# Altium schematic sheet PowerOut.SchDoc
size Tabloid
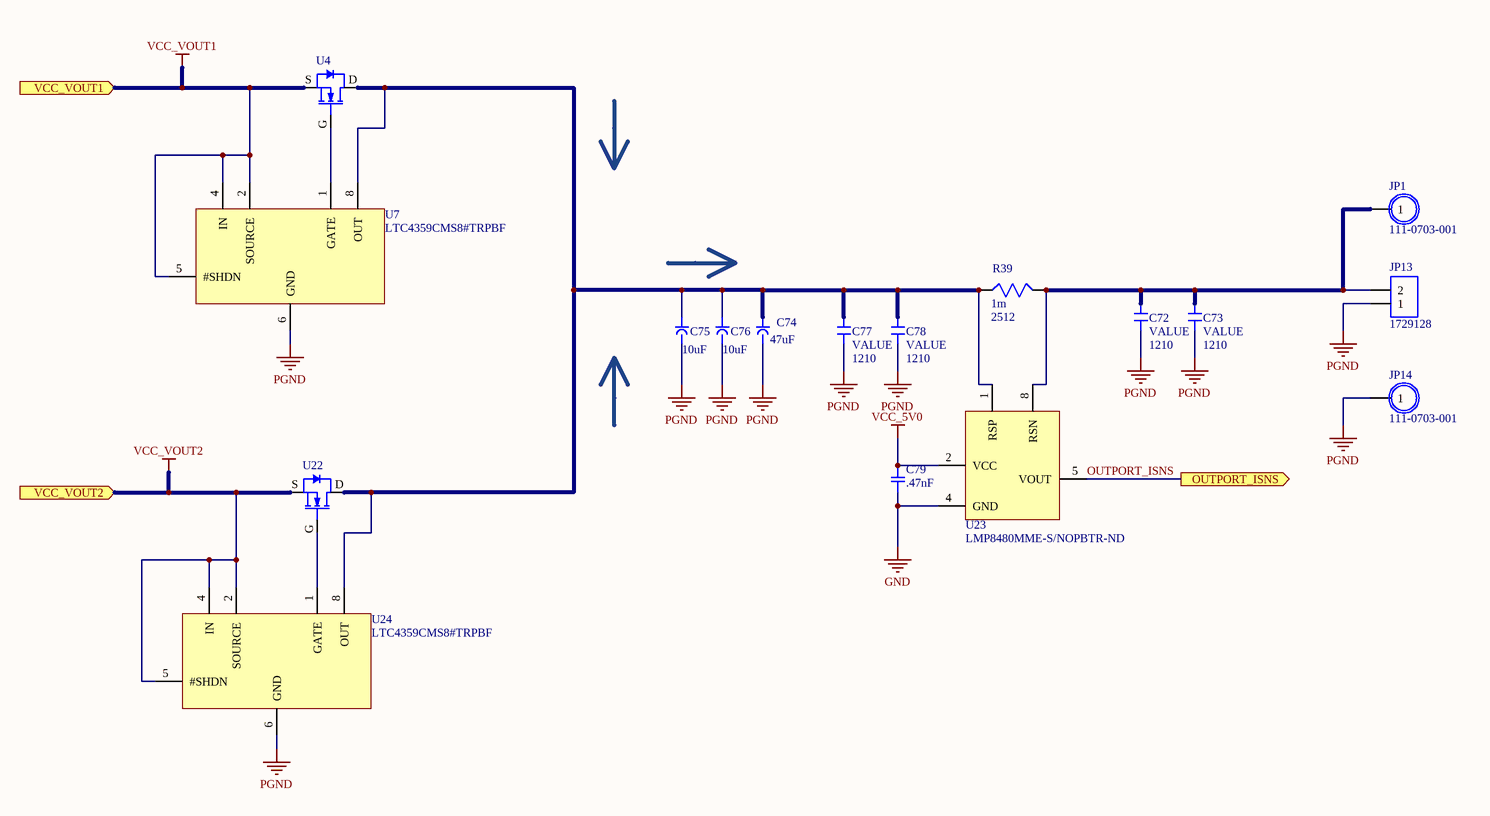
[diagram p0: PowerOut.SchDoc]

## Parts
C72  VALUE  Size: 1210  [1210 cap]
C73  VALUE  Size: 1210  [1210 cap]
C74  10-EEE-FN1K470UVTR-ND  [EEE-FN1K470UV]  (value not drawn)
C75  value 10uF  [panasonic d8]  (hidden comment: EEE-FN1K100XL)
C76  value 10uF  [panasonic d8]  (hidden comment: EEE-FN1K100XL)
C77  VALUE  Size: 1210  [1210 cap]
C78  VALUE  Size: 1210  [1210 cap]
C79  .47nF  [SMD-0603C]
JP1  111-0703-001  [Banana Jack Post]
JP13  1729128  [2x1_Term_Block]
JP14  111-0703-001  [Banana Jack Post]
R39  1m  [2512]
U4  (no value)  [PowerPAK® SO-8L SINGLE]
U7  LTC4359CMS8#TRPBF  [8-MSOP]
U22  (no value)  [PowerPAK® SO-8L SINGLE]
U23  LMP8480MME-S/NOPBTR-ND  [DGK(S-PDSO-G8)]
U24  LTC4359CMS8#TRPBF  [8-MSOP]

## Ports
OUTPORT_ISNS (out), VCC_VOUT1 (in), VCC_VOUT2 (in)

## Nets
GND: C79.2 U23.4(GND)
PGND: C72.2 C73.2 C74.1 C75.2 C76.2 C77.2 C78.2 JP13.1 JP14.1 U7.6(GND) U24.6(GND)
VCC_5V0: C79.1 U23.2(VCC)
VCC_VOUT1: U4.S(SOURCE) U7.2(SOURCE) U7.4(IN) U7.5(#SHDN) ; port VCC_VOUT1
VCC_VOUT2: U22.S(SOURCE) U24.2(SOURCE) U24.4(IN) U24.5(#SHDN) ; port VCC_VOUT2
OUTPORT_ISNS: U23.5(VOUT) ; port OUTPORT_ISNS
NetC72_1: C72.1 C73.1 JP1.1 JP13.2 R39.2 U23.8(RSN)
NetC74_2: C74.2 C75.1 C76.1 C77.1 C78.1 R39.1 U4.D(DRAIN) U7.8(OUT) U22.D(DRAIN) U23.1(RSP) U24.8(OUT)
NetU4_G: U4.G(GATE) U7.1(GATE)
NetU22_G: U22.G(GATE) U24.1(GATE)

## Notes on the sheet
- (in symbol CAP ALUM 47UF) 47uF

## Library data of the parts
C72 C73 C77 C78 = CAP SMD 1210
C74 = CAP ALUM 47UF: CAP ALUM 47UF 20% 80V SMD
C75 C76 = CAP ALUM 10UF: CAP ALUM 10UF 20% 80V SMD
C79 = GCJ188R71H222KA01D: CAP CER 2200PF 50V X7R 0603; Manufacturer: Murata Electronics North America; Factory Stock: 0; Unit Price (USD): 0.16; Minimum Quantity: 1; Tolerance: ±10%; Datasheets: http://www.murata.com/~/media/webrenewal/support/library/catalog/products/capacitor/mlcc/c03e.ashx; Image: //media.digikey.com/Renders/Murata%20Renders/0603%28LQG18%29.jpg; Digi-Key Part Number: 490-5766-1-ND; Part Number: GCJ188R71H222KA01D; Quantity Available: 34786; @ qty: 0; Packaging: Cut Tape (CT); Series: GCJ; Part Status: Active; Value: 2200pF; Voltage: 50V; Temperature Coefficient: X7R; Operating Temperature: -55°C ~ 125°C; Features: Soft Termination; Ratings: AEC-Q200; Applications: Automotive, Boardflex Sensitive; Mounting Type: Surface Mount, MLCC; Package / Case: 0603 (1608 Metric); Size / Dimension: 0.063" L x 0.031" W (1.60mm x 0.80mm); Height - Seated (Max): -; Thickness (Max): 0.031" (0.80mm); Lead Spacing: -; Lead Style: -
JP1 JP14 = CONN BANANA JACK: CONN BIND POST KNURLED BLACK‎
JP13 = TERM BLK 2P SIDE ENT 5.08MM: Phoenix Contact-1729128
R39 = RES SMD 2512: RES SMD 2512 2W; Size: 2512
U4 U22 = FET SQJA80EP-T1_GE3: MOSFET N-CH 80V 60A PPAK SO-8
U7 U24 = IC LTC4359: OR Controller N+1 ORing Controller N-Channel N:1 8-MSOP
U23 = IC LMP8480: IC CURR SENSE 1 CIRCUIT 8VSSOP